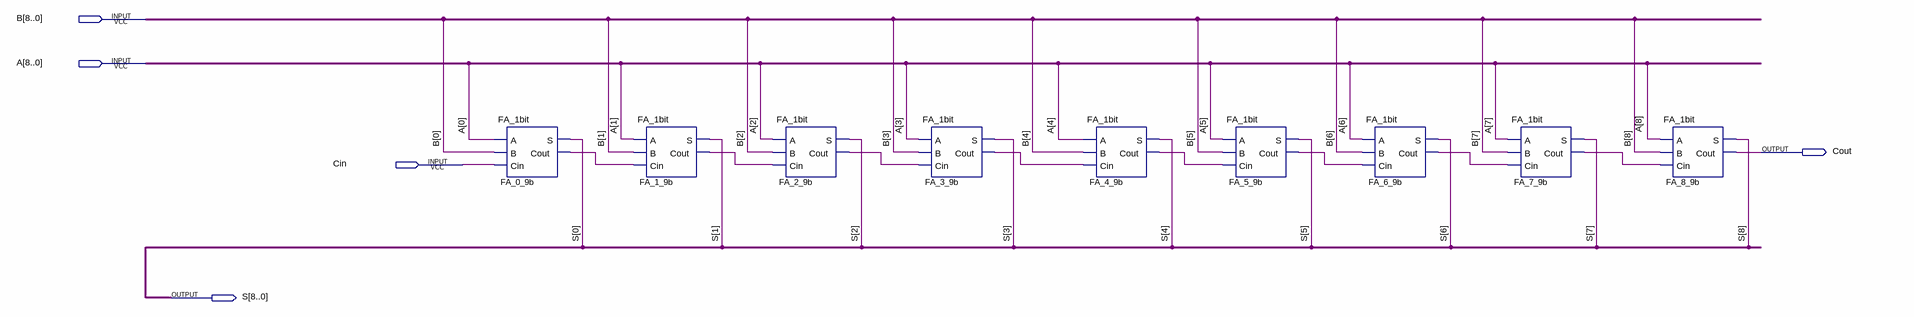
[diagram p0: schematic sheet]
// Quartus schematic FA_9bit.bdf as structural Verilog: 9 symbols, 5 pins
module FA_9bit (
  input  [8:0] B,
  input  [8:0] A,
  input  Cin,
  output Cout,
  output [8:0] S
);

  wire FA_0_9b_cout, FA_1_9b_cout, FA_2_9b_cout, FA_3_9b_cout, FA_4_9b_cout, FA_5_9b_cout, FA_6_9b_cout,
       FA_7_9b_cout;

  FA_1bit FA_0_9b (.A(A[0]), .B(B[0]), .Cin(Cin), .S(S[0]), .Cout(FA_0_9b_cout));
  FA_1bit FA_1_9b (.A(A[1]), .B(B[1]), .Cin(FA_0_9b_cout), .S(S[1]), .Cout(FA_1_9b_cout));
  FA_1bit FA_2_9b (.A(A[2]), .B(B[2]), .Cin(FA_1_9b_cout), .S(S[2]), .Cout(FA_2_9b_cout));
  FA_1bit FA_3_9b (.A(A[3]), .B(B[3]), .Cin(FA_2_9b_cout), .S(S[3]), .Cout(FA_3_9b_cout));
  FA_1bit FA_4_9b (.A(A[4]), .B(B[4]), .Cin(FA_3_9b_cout), .S(S[4]), .Cout(FA_4_9b_cout));
  FA_1bit FA_5_9b (.A(A[5]), .B(B[5]), .Cin(FA_4_9b_cout), .S(S[5]), .Cout(FA_5_9b_cout));
  FA_1bit FA_6_9b (.A(A[6]), .B(B[6]), .Cin(FA_5_9b_cout), .S(S[6]), .Cout(FA_6_9b_cout));
  FA_1bit FA_7_9b (.A(A[7]), .B(B[7]), .Cin(FA_6_9b_cout), .S(S[7]), .Cout(FA_7_9b_cout));
  FA_1bit FA_8_9b (.A(A[8]), .B(B[8]), .Cin(FA_7_9b_cout), .S(S[8]), .Cout(Cout));
endmodule
